# Altium schematic sheet main.SchDoc
size A4
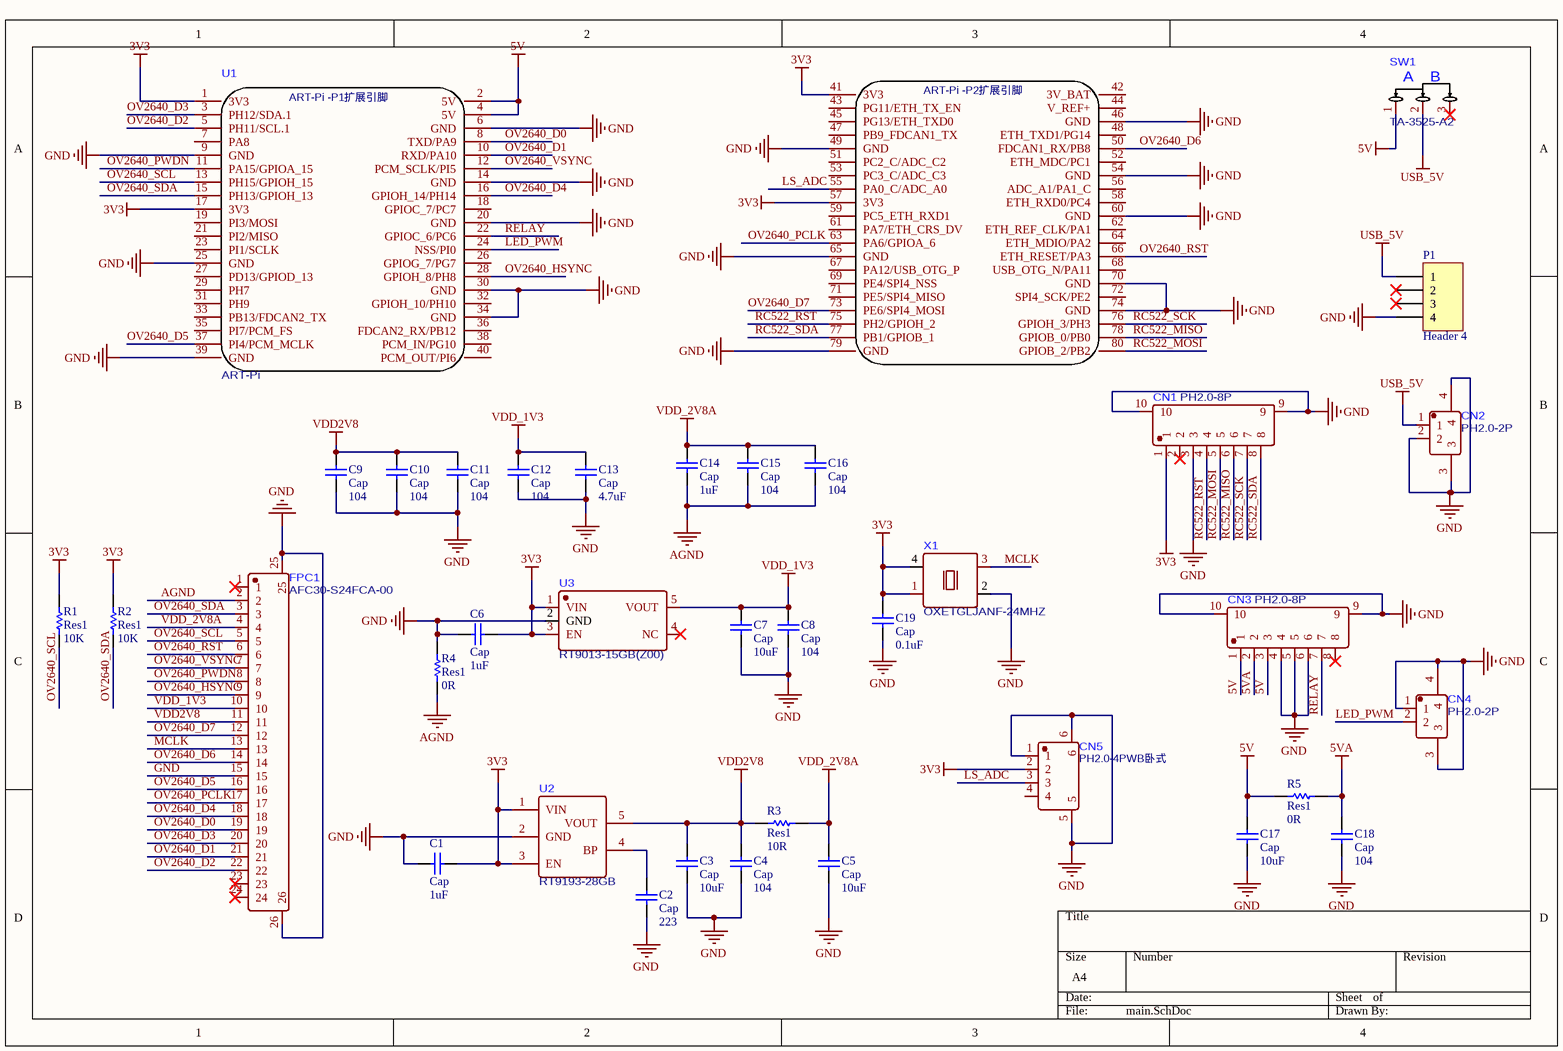
[diagram p0: main.SchDoc]

## Parts
C1  Cap  value 1uF  [R0603]
C2  Cap  value 223  [R0603]
C3  Cap  value 10uF  [R0603]
C4  Cap  value 104  [R0603]
C5  Cap  value 10uF  [R0603]
C6  Cap  value 1uF  [R0603]
C7  Cap  value 10uF  [R0603]
C8  Cap  value 104  [R0603]
C9  Cap  value 104  [R0603]
C10  Cap  value 104  [R0603]
C11  Cap  value 104  [R0603]
C12  Cap  value 104  [R0603]
C13  Cap  value 4.7uF  [R0603]
C14  Cap  value 1uF  [R0603]
C15  Cap  value 104  [R0603]
C16  Cap  value 104  [R0603]
C17  Cap  value 10uF  [R0603]
C18  Cap  value 104  [R0603]
C19  Cap  value 0.1uF  [R0603]
CN1  PH2.0-8P  [CONN-SMD_X2016WRS-08-9TSW]
CN2  PH2.0-2P  [CONN-SMD_PH2.0-1X2PW]
CN3  PH2.0-8P  [CONN-SMD_X2016WRS-08-9TSW]
CN4  PH2.0-2P  [CONN-SMD_PH2.0-1X2PW]
CN5  PH2.0-4PWB卧式  [CONN-SMD_PH2.0-4PWB]
FPC1  AFC30-S24FCA-00  [FPC-SMD_AFC30-S24FCA-00]
P1  Header 4  [HDR1X4]
R1  Res1  value 10K  [R0603]
R2  Res1  value 10K  [R0603]
R3  Res1  value 10R  [R0603]
R4  Res1  value 0R  [R0603]
R5  Res1  value 0R  [R0603]
SW1  TA-3525-A2  [SW-SMD_3P-L9.1-W3.5-P2.50-EH6.8]
U1  ART-Pi  [PCBComponent_1 - duplicate]
U2  RT9193-28GB  [SOT-23-5_L3.0-W1.7-P0.95-LS2.8-BR]
U3  RT9013-15GB(Z00)  [SOT-23-5_L3.0-W1.7-P0.95-LS2.8-BR]
X1  OXETGLJANF-24MHZ  [OSC-SMD_4P-L3.2-W2.5-BL]

## Nets
3V3: C1.1 C6.1 C19.2 CN1.1 CN5.2 R1.2 R2.2 U1.1(3V3) U1.17(3V3) U1.41(3V3) U1.57(3V3) U2.1(VIN) U2.3(EN) U3.1(VIN) U3.3(EN) X1.1(tri) X1.4(VCC)
5V: C17.2 CN3.1 CN3.3 R5.1 SW1.1 U1.2(5V) U1.4(5V)
5VA: C18.2 CN3.2 R5.2
AGND: C14.1 C15.1 C16.1 FPC1.2 R4.1
GND: C1.2 C2.1 C3.1 C4.1 C5.1 C6.2 C7.1 C8.1 C9.1 C10.1 C11.1 C12.1 C13.1 C17.1 C18.1 C19.1 CN1.3 CN1.9 CN1.10 CN2.2 CN2.3 CN2.4 CN3.4 CN3.5 CN3.6 CN3.9 CN3.10 CN4.1 CN4.3 CN4.4 CN5.1 CN5.5 CN5.6 FPC1.15 FPC1.25 FPC1.26 P1.4 R4.2 U1.6(GND) U1.9(GND) U1.14(GND) U1.20(GND) U1.25(GND) U1.30(GND) U1.34(GND) U1.39(GND) U1.46(GND) U1.49(GND) U1.54(GND) U1.60(GND) U1.65(GND) U1.70(GND) U1.74(GND) U1.79(GND) U2.2(GND) U3.2(GND) X1.2(GND)
USB_5V: CN2.1 P1.1 SW1.2
VDD2V8: C3.2 C4.2 C9.2 C10.2 C11.2 FPC1.11 R3.1 U2.5(VOUT)
VDD_1V3: C7.2 C8.2 C12.2 C13.2 FPC1.10 U3.5(VOUT)
VDD_2V8A: C5.2 C14.2 C15.2 C16.2 FPC1.4 R3.2
LED_PWM: CN4.2 U1.24(NSS/PI0)
LS_ADC: CN5.3 U1.55(PA0_C/ADC_A0)
MCLK: FPC1.13 X1.3(OUT)
OV2640_D0: FPC1.19 U1.8(TXD/PA9)
OV2640_D1: FPC1.21 U1.10(RXD/PA10)
OV2640_D2: FPC1.22 U1.5(PH11/SCL.1)
OV2640_D3: FPC1.20 U1.3(PH12/SDA.1)
OV2640_D4: FPC1.18 U1.16(GPIOH_14/PH14)
OV2640_D5: FPC1.16 U1.37(PI4/PCM_MCLK)
OV2640_D6: FPC1.14 U1.50(FDCAN1_RX/PB8)
OV2640_D7: FPC1.12 U1.73(PE6/SPI4_MOSI)
OV2640_HSYNC: FPC1.9 U1.28(GPIOH_8/PH8)
OV2640_PCLK: FPC1.17 U1.63(PA6/GPIOA_6)
OV2640_PWDN: FPC1.8 U1.11(PA15/GPIOA_15)
OV2640_RST: FPC1.6 U1.66(ETH_RESET/PA3)
OV2640_SCL: FPC1.5 R1.1 U1.13(PH15/GPIOH_15)
OV2640_SDA: FPC1.3 R2.1 U1.15(PH13/GPIOH_13)
OV2640_VSYNC: FPC1.7 U1.12(PCM_SCLK/PI5)
RC522_MISO: CN1.6 U1.78(GPIOB_0/PB0)
RC522_MOSI: CN1.5 U1.80(GPIOB_2/PB2)
RC522_RST: CN1.4 U1.75(PH2/GPIOH_2)
RC522_SCK: CN1.7 U1.76(GPIOH_3/PH3)
RC522_SDA: CN1.8 U1.77(PB1/GPIOB_1)
RELAY: CN3.7 U1.22(GPIOC_6/PC6)
NetC2_2: C2.2 U2.4(BP)

Not connected (* = marked no-connect by the designer): CN1 2*; CN3 8*; CN5 4; FPC1 1* 23* 24*; P1 2* 3*; SW1 3*; U1 7(PA8) 18(GPIOC_7/PC7) 19(PI3/MOSI) 21(PI2/MISO) 23(PI1/SCLK) 26(GPIOG_7/PG7) 27(PD13/GPIOD_13) 29(PH7) 31(PH9) 32(GPIOH_10/PH10) 33(PB13/FDCAN2_TX) 35(PI7/PCM_FS) 36(FDCAN2_RX/PB12) 38(PCM_IN/PG10) 40(PCM_OUT/PI6) 42(3V_BAT) 43(PG11/ETH_TX_EN) 44(V_REF+) 45(PG13/ETH_TXD0) 47(PB9_FDCAN1_TX) 48(ETH_TXD1/PG14) 51(PC2_C/ADC_C2) 52(ETH_MDC/PC1) 53(PC3_C/ADC_C3) 56(ADC_A1/PA1_C) 58(ETH_RXD0/PC4) 59(PC5_ETH_RXD1) 61(PA7/ETH_CRS_DV) 62(ETH_REF_CLK/PA1) 64(ETH_MDIO/PA2) 67(PA12/USB_OTG_P) 68(USB_OTG_N/PA11) 69(PE4/SPI4_NSS) 71(PE5/SPI4_MISO) 72(SPI4_SCK/PE2); U3 4(NC)*

## Notes on the sheet
- (in symbol ART-Pi) ART-Pi -P2扩展引脚; ART-Pi -P1扩展引脚
- (in symbol TA-3525-A2) A; B

## Library data of the parts
C1-C19 = Cap: Capacitor; Published: 8-Jun-2000; LatestRevisionDate: 17-Jul-2002; LatestRevisionNote: Re-released for DXP Platform.; PackageReference: RAD-0.3; Publisher: Altium Limited; PackageDescription: Radial Cap, Thru-Hole; 2 Leads; 0.3 in Pin Spacing
P1 = Header 4: Header, 4-Pin; LatestRevisionDate: 17-Jul-2002; LatestRevisionNote: Re-released for DXP Platform.; Publisher: Altium Limited
R1-R5 = Res1: Resistor; Published: 8-Jun-2000; LatestRevisionDate: 17-Jul-2002; LatestRevisionNote: Re-released for DXP Platform.; PackageReference: AXIAL-0.3; Publisher: Altium Limited; PackageDescription: Axial Device, Thru-Hole; 2 Leads; 0.3 in Pin Spacing